# Altium project ECU V1.0 B.PrjPcb (part 3 of 17)
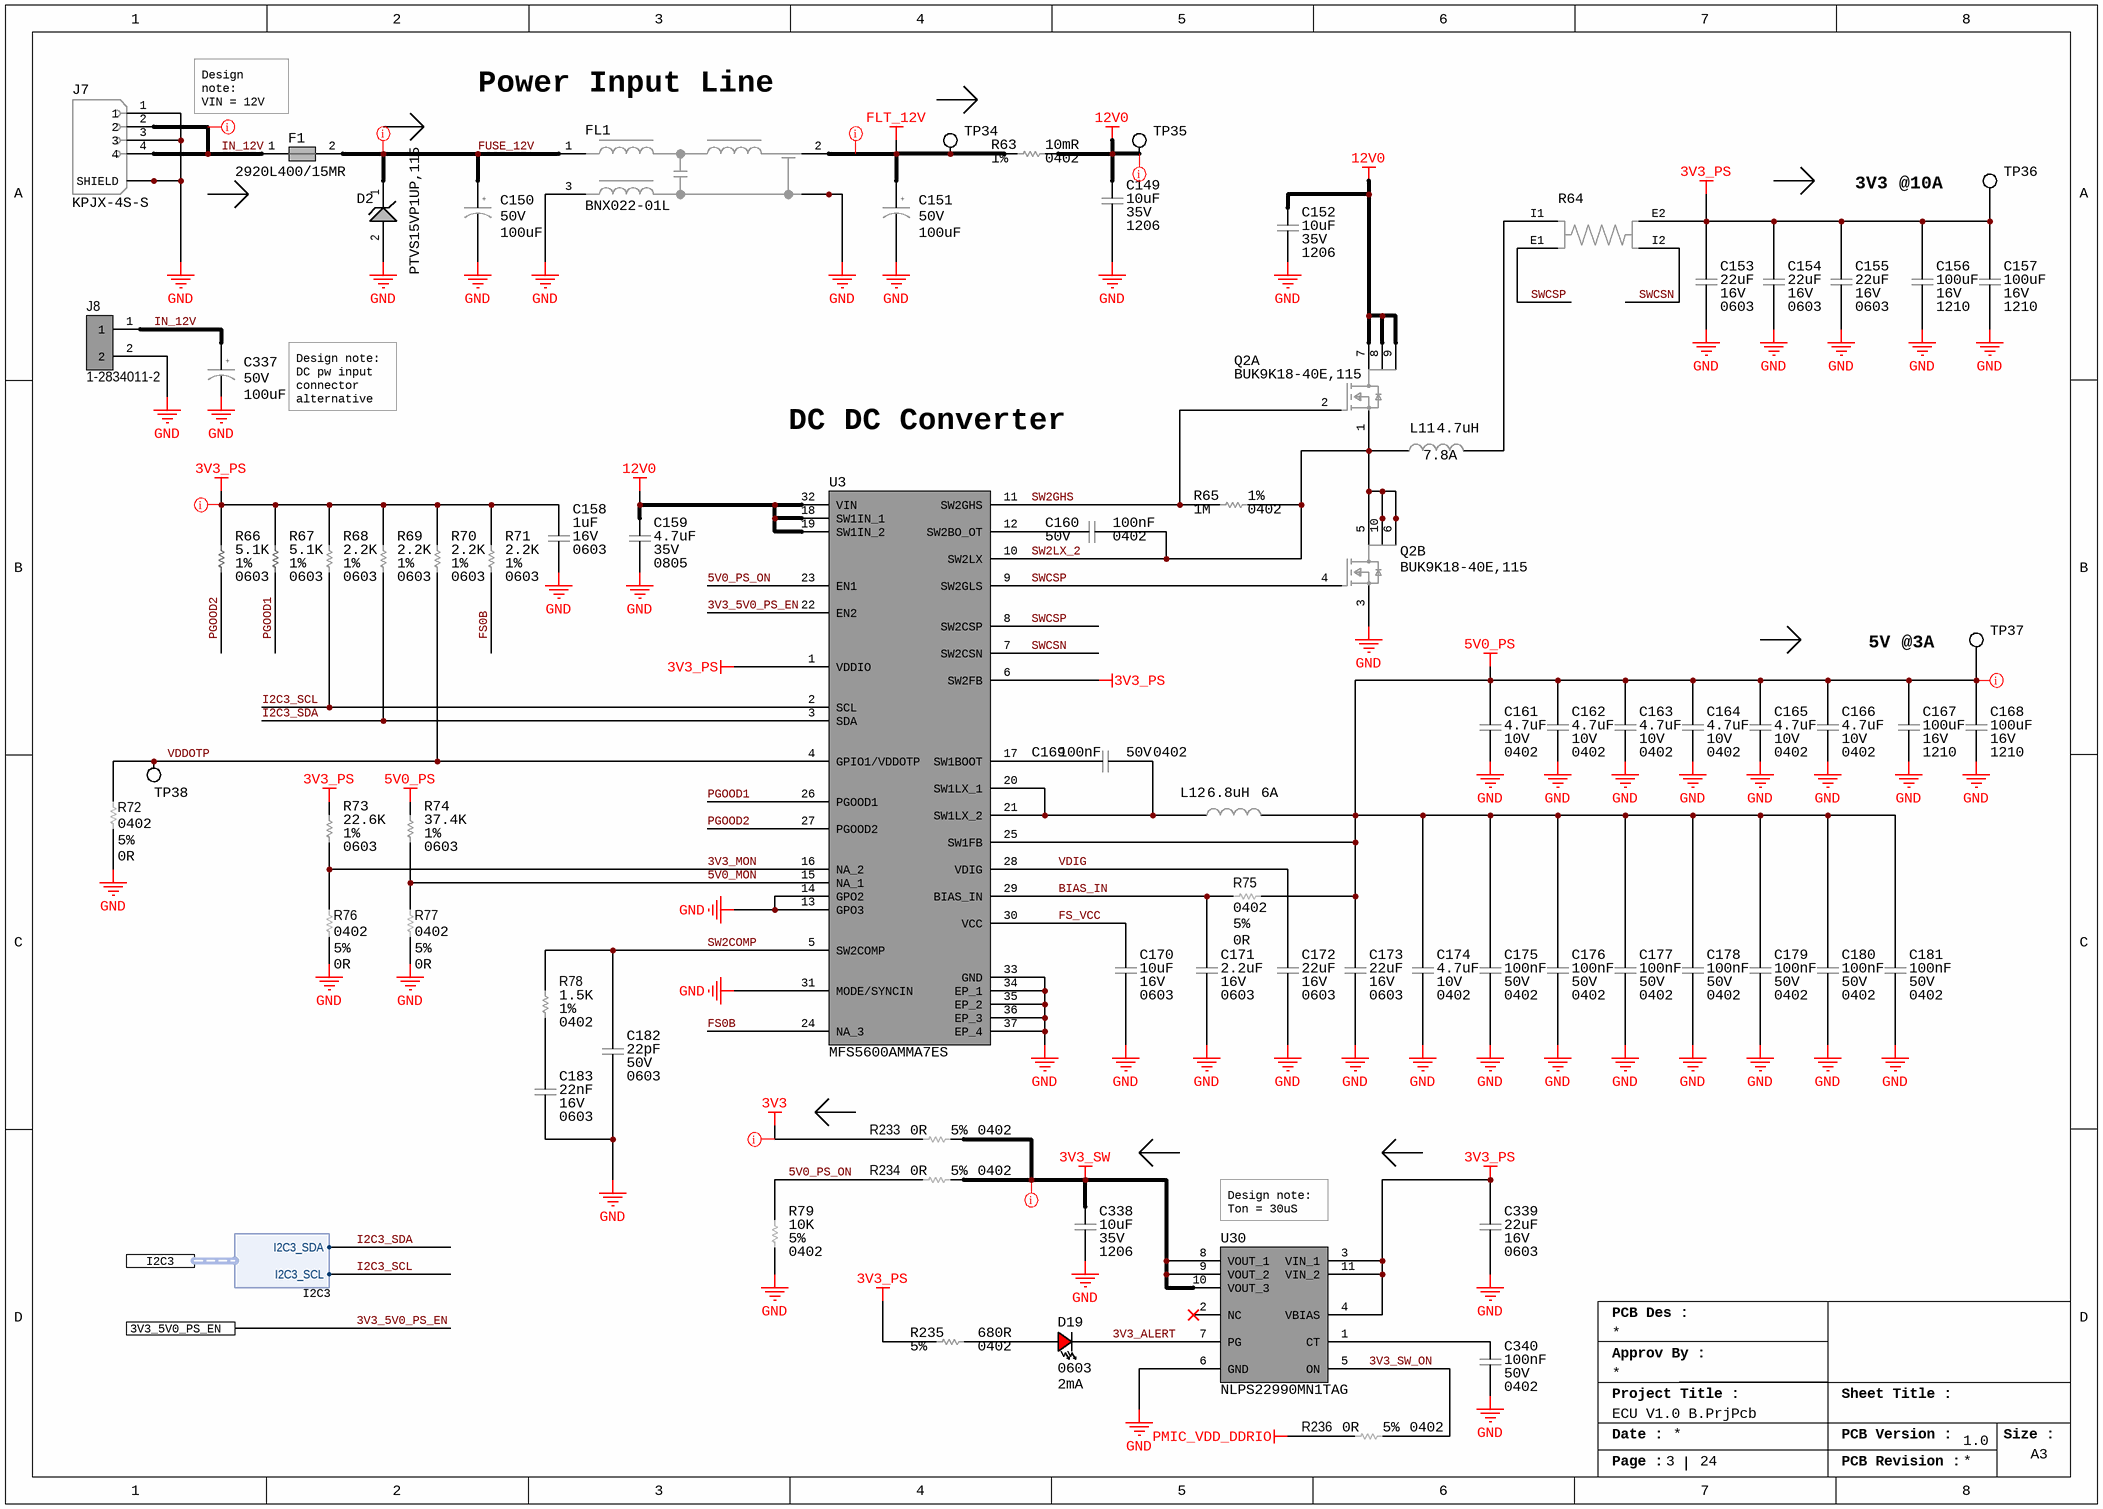
[diagram p19: 02_PWR IN.SchDoc]

## Sheet 02_PWR IN.SchDoc (continued)

### Library data of the parts (continued)
R72 R75-R77 R233 R234 R236 = RES_0R_5%_100mW_0402: SMD Chip Resistor, Jumper, 0 ohm, 100 mW, 0402 [1005 Metric], Thick Film, General Purpose; Manufacturer: Panasonic; Power Rating: 100mW; Voltage Rating: 50V; Temperature Coefficient: 600ppm/°C; Supplier 1: Mouser; Manufacturer Part Number: ERJ-2GE0R00X; RoHS: Yes; Category: Chip SMD Resistors; Stock 1: 10989354; Pricing 1: 1=0.1, 10=0.013, 50=0.013, 100=0.006, 1000=0.004, 2500=0.003, 10000=0.003 (USD); Mount: Surface Mount; Case/Package: 0402; Contact Plating: Tin; Case Code (Metric): 1005; Size Code: 0402; Min Operating Temperature: -55°C; Max Operating Temperature: 155°C; Resistor Type: Thick Film; Packaging: Cut Tape; Package Quantity: 10000; Number of Terminations: 2; Termination: SMD/SMT; Max Power Dissipation: 100mW; Voltage Rating (DC): 50V; Features: Automotive AEC-Q200; Series: ERJ; Construction: Rectangular; Technology: THICK FILM; Length: 1mm; Width: 0.5mm; Height: 0.35mm; Depth: 0.5mm; Ratings: AEC-Q200; Radiation Hardening: No; Reach SVHC Compliant: No; Military Standard: Not; Lead Free: Lead Free; RoHS Compliant: Yes; ComponentLink1URL: https://datasheet.ciiva.com/11821/0900766b80f806dd-11821176.pdf?src-supplier=Rs; ComponentLink1Description: https://datasheet.ciiva.com/11821/0900766b80f806dd-11821176.pdf?src-supplier=Rs; ComponentLink2URL: https://datasheet.ciiva.com/43460/1678796-43460347.pdf?src-supplier=Farnell; ComponentLink2Description: https://datasheet.ciiva.com/43460/1678796-43460347.pdf?src-supplier=Farnell; ComponentLink3URL: https://datasheet.ciiva.com/46389/1678796-46389518.pdf?src-supplier=Element14; ComponentLink3Description: https://datasheet.ciiva.com/46389/1678796-46389518.pdf?src-supplier=Element14; ComponentLink4URL: https://datasheet.ciiva.com/5959/1678796-5959692.pdf?src-supplier=Farnell; ComponentLink4Description: https://datasheet.ciiva.com/5959/1678796-5959692.pdf?src-supplier=Farnell; ComponentLink5URL: https://datasheet.ciiva.com/28695/1678796-28695758.pdf?src-supplier=Element14; ComponentLink5Description: https://datasheet.ciiva.com/28695/1678796-28695758.pdf?src-supplier=Element14; ComponentLink6URL: https://datasheet.ciiva.com/16783/70260739-16783734.pdf?src-supplier=Allied+Electronics; ComponentLink6Description: https://datasheet.ciiva.com/16783/70260739-16783734.pdf?src-supplier=Allied+Electronics; ComponentLink7URL: https://datasheet.ciiva.com/16778/70260739-16778335.pdf?src-supplier=Allied+Electronics; ComponentLink7Description: https://datasheet.ciiva.com/16778/70260739-16778335.pdf?src-supplier=Allied+Electronics; ComponentLink8URL: https://datasheet.ciiva.com/48531/aoa0000ce1-48531077.pdf?src-supplier=Avnet; ComponentLink8Description: https://datasheet.ciiva.com/48531/aoa0000ce1-48531077.pdf?src-supplier=Avnet; ComponentLink9URL: https://datasheet.ciiva.com/30097/4aoa0000ce1-30097116.pdf?src-supplier=Onlinecomponents.com; ComponentLink9Description: https://datasheet.ciiva.com/30097/4aoa0000ce1-30097116.pdf?src-supplier=Onlinecomponents.com; Supplier Part Number 1: 667-ERJ-2GE0R00X
R73 = RES_22.6K_1%_100mW_0603: Res Thick Film 0603 22.6K Ohm 1% 0.1W(1/10W) ±100ppm/C Pad SMD Automotive T/R; Manufacturer: Yageo; Voltage Rating: 50V; Power Rating: 100mW; Temperature Coefficient: 100ppm/°C; Supplier 1: Digikey; Manufacturer Part Number: AC0603FR-0722K6L; RoHS: Yes; Category: Chip SMD Resistors; Stock 1: 61415; Pricing 1: 1=0.1, 10=0.011, 100=0.0102, 1000=0.00816 (USD); Case Code (Imperial): 0603; Case Code (Metric): 1608; Weight: 7.1E-05oz; Min Operating Temperature: -55°C; Max Operating Temperature: 155°C; Packaging: Tape and Reel; Number of Terminations: 2; Termination: SMD/SMT; Max Power Dissipation: 100mW; Features: Moisture Resistant,Automotive AEC-Q200; Series: AC; Length: 0.063inch; Width: 0.8mm; Height: 0.022inch; RoHS Compliant: Yes; ComponentLink1URL: https://datasheet.ciiva.com/12576/pyu-ac-51-rohs-l-2-12576573.pdf?src-supplier=Mouser; ComponentLink1Description: https://datasheet.ciiva.com/12576/pyu-ac-51-rohs-l-2-12576573.pdf?src-supplier=Mouser; Supplier Part Number 1: 13-AC0603FR-0722K6LCT-ND
R74 = RES_37.4K_1%_100mW_0603: SMD Chip Resistor, 37.4 kOhm, ± 1%, 100 mW, 0603 [1608 Metric], Thick Film, General Purpose; Manufacturer: Yageo; Power Rating: 100mW; Voltage Rating: 50V; Temperature Coefficient: 100ppm/°C; Supplier 1: Digikey; Manufacturer Part Number: RC0603FR-0737K4L; RoHS: Yes; Category: Chip SMD Resistors; Stock 1: 85298; Pricing 1: 1=0.1, 10=0.009, 100=0.0071, 1000=0.00612 (USD); Case Code (Metric): 1608; Case Code (Imperial): 0603; Size Code: 0603; Min Operating Temperature: -55°C; Max Operating Temperature: 155°C; Package Quantity: 1; Packaging: Tape and Reel; Number of Terminations: 2; Termination: SMD/SMT; Max Power Dissipation: 100mW; Voltage Rating (DC): 50V; Features: Moisture Resistant; Series: RC; Length: 0.063inch; Width: 0.031inch; Height: 0.022inch; Lead Free: Lead Free; RoHS Compliant: Yes; ComponentLink1URL: https://datasheet.ciiva.com/2455/pyu-r-int-thick-7-2455137.pdf?src-supplier=Digikey; ComponentLink1Description: https://datasheet.ciiva.com/2455/pyu-r-int-thick-7-2455137.pdf?src-supplier=Digikey; ComponentLink2URL: https://datasheet.ciiva.com/2455/pyu-r-int-thick-7-2455138.pdf?src-supplier=Digikey; ComponentLink2Description: https://datasheet.ciiva.com/2455/pyu-r-int-thick-7-2455138.pdf?src-supplier=Digikey; ComponentLink3URL: https://datasheet.ciiva.com/2455/pyu-r-int-thick-7-2455139.pdf?src-supplier=Digikey; ComponentLink3Description: https://datasheet.ciiva.com/2455/pyu-r-int-thick-7-2455139.pdf?src-supplier=Digikey; Supplier Part Number 1: 311-37.4KHRDKR-ND
R78 = RES_1.5K_1%_63mW_0402: Res Thick Film 0402 1.5K Ohm 1% 1/16W ±100ppm/°C Molded SMD SMD Paper Tape on Plastic Reel; Manufacturer: Bourns; Power Rating: 62.5mW; Voltage Rating: 50V; Max Power Dissipation: 63mW; Supplier 1: Digi-Key; Manufacturer Part Number: CR0402-FX-1501GLF; RoHS: Yes; Category: Chip SMD Resistors; Stock 1: 177147; Pricing 1: 1=0.1, 10=0.011, 50=0.0064, 100=0.0051, 500=0.00326, 1000=0.00275, 5000=0.0019 (USD); Mount: Surface Mount; Case Code (Metric): 1005; Case Code (Imperial): 0402; Contact Plating: Tin; Min Operating Temperature: -55°C; Max Operating Temperature: 125°C; Package Quantity: 10000; Packaging: Tape and Reel; Number of Terminations: 2; Termination: SMD/SMT; Temperature Coefficient: 100ppm/°C; Series: CR0402; Voltage Rating (DC): 50V; Length: 0.039inch; Width: 0.5mm; Height: 0.016inch; Thickness: 356um; Radiation Hardening: No; RoHS Compliant: Yes; ComponentLink1URL: https://datasheet.ciiva.com/9123/cr0402-9123423.pdf?src-supplier=Avnet; ComponentLink1Description: https://datasheet.ciiva.com/9123/cr0402-9123423.pdf?src-supplier=Avnet; ComponentLink2URL: https://datasheet.ciiva.com/30173/cr0402-30173227.pdf?src-supplier=Onlinecomponents.com; ComponentLink2Description: https://datasheet.ciiva.com/30173/cr0402-30173227.pdf?src-supplier=Onlinecomponents.com; Supplier Part Number 1: CR0402-FX-1501GLFCT-ND
R79 = RES_10K_5%_100mW_0402: Res Thick Film 0402 10K Ohm 5% 1/10W ±200ppm/°C Molded SMD Punched Carrier T/R; Manufacturer: Panasonic; Power Rating: 100mW; Voltage Rating: 50V; Supplier 1: Digi-Key; Manufacturer Part Number: ERJ-2GEJ103X; RoHS: Yes; Category: Chip SMD Resistors; Stock 1: 4696986; Pricing 1: 1=0.1, 10=0.021, 50=0.0132, 100=0.011, 500=0.00744, 1000=0.00639, 5000=0.00464 (USD); Mount: Surface Mount; Contact Plating: Tin; Case Code (Metric): 1005; Case Code (Imperial): 0402; Size Code: 0402; Min Operating Temperature: -55°C; Max Operating Temperature: 155°C; Temperature Coefficient: 200ppm/°C; Packaging: Cut Tape; Resistor Type: Thick Film; Package Quantity: 10000; Number of Terminations: 2; Termination: SMD/SMT; Max Power Dissipation: 100mW; Features: Automotive AEC-Q200; Series: ERJ; Resistance Tolerance: 5%; Technology: THICK FILM; Voltage Rating (DC): 50V; Length: 1mm; Width: 0.5mm; Height: 0.35mm; Depth: 0.5mm; Ratings: AEC-Q200; Radiation Hardening: No; Reach SVHC Compliant: No; RoHS Compliant: Yes; Lead Free: 5697LeadFree; ComponentLink1URL: https://datasheet.ciiva.com/27055/1935721-27055112.pdf?src-supplier=Jameco; ComponentLink1Description: https://datasheet.ciiva.com/27055/1935721-27055112.pdf?src-supplier=Jameco; ComponentLink2URL: https://datasheet.ciiva.com/11821/0900766b80f806dd-11821170.pdf?src-supplier=Rs; ComponentLink2Description: https://datasheet.ciiva.com/11821/0900766b80f806dd-11821170.pdf?src-supplier=Rs; ComponentLink3URL: https://datasheet.ciiva.com/43460/1678796-43460391.pdf?src-supplier=Farnell; ComponentLink3Description: https://datasheet.ciiva.com/43460/1678796-43460391.pdf?src-supplier=Farnell; ComponentLink4URL: https://datasheet.ciiva.com/22785/1678796-22785949.pdf?src-supplier=Farnell; ComponentLink4Description: https://datasheet.ciiva.com/22785/1678796-22785949.pdf?src-supplier=Farnell; ComponentLink5URL: https://datasheet.ciiva.com/46371/1678796-46371910.pdf?src-supplier=Element14; ComponentLink5Description: https://datasheet.ciiva.com/46371/1678796-46371910.pdf?src-supplier=Element14; ComponentLink6URL: https://datasheet.ciiva.com/28514/1678796-28514154.pdf?src-supplier=Element14; ComponentLink6Description: https://datasheet.ciiva.com/28514/1678796-28514154.pdf?src-supplier=Element14; ComponentLink7URL: https://datasheet.ciiva.com/24070/aoa0000ce1-37422-24070679.pdf?src-supplier=Mouser; ComponentLink7Description: https://datasheet.ciiva.com/24070/aoa0000ce1-37422-24070679.pdf?src-supplier=Mouser; ComponentLink8URL: https://datasheet.ciiva.com/16767/70260739-16767130.pdf?src-supplier=Allied+Electronics; ComponentLink8Description: https://datasheet.ciiva.com/16767/70260739-16767130.pdf?src-supplier=Allied+Electronics; ComponentLink9URL: https://datasheet.ciiva.com/16774/70260739-16774504.pdf?src-supplier=Allied+Electronics; ComponentLink9Description: https://datasheet.ciiva.com/16774/70260739-16774504.pdf?src-supplier=Allied+Electronics; ComponentLink10URL: https://datasheet.ciiva.com/9194/aoa0000ce1-9194140.pdf?src-supplier=Avnet; ComponentLink10Description: https://datasheet.ciiva.com/9194/aoa0000ce1-9194140.pdf?src-supplier=Avnet; Supplier Part Number 1: P10KJCT-ND
R235 = RES_680R_5%_100mW_0402: SMD Chip Resistor, 680 Ohm, ± 5%, 100 mW, 0402 [1005 Metric], Thick Film, General Purpose; Manufacturer: Panasonic; Voltage Rating: 50V; Power Rating: 100mW; Temperature Coefficient: 200ppm/°C; Supplier 1: Digikey; Manufacturer Part Number: ERJ-2GEJ681X; RoHS: Yes; Category: Chip SMD Resistors; Stock 1: 172084; Pricing 1: 1=0.1, 10=0.022, 50=0.0134, 100=0.0111, 500=0.00742, 1000=0.00635, 5000=0.00459 (USD); Mount: Surface Mount; Case Code (Metric): 1005; Case Code (Imperial): 0402; Contact Plating: Tin; Min Operating Temperature: -55°C; Max Operating Temperature: 155°C; Packaging: Tape and Reel; Package Quantity: 10000; Resistor Type: Thick Film; Number of Terminations: 2; Termination: SMD/SMT; Max Power Dissipation: 100mW; Voltage Rating (DC): 50V; Features: Automotive AEC-Q200; Series: ERJ; Technology: THICK FILM; Resistance Tolerance: 5%; Length: 1mm; Width: 0.5mm; Height: 0.35mm; Depth: 0.5mm; Ratings: AEC-Q200; Reach SVHC Compliant: No; RoHS Compliant: Yes; ComponentLink1URL: https://datasheet.ciiva.com/11821/0900766b80f806dd-11821377.pdf?src-supplier=Rs; ComponentLink1Description: https://datasheet.ciiva.com/11821/0900766b80f806dd-11821377.pdf?src-supplier=Rs; ComponentLink2URL: https://datasheet.ciiva.com/24071/aoa0000ce1-37422-24071113.pdf?src-supplier=Mouser; ComponentLink2Description: https://datasheet.ciiva.com/24071/aoa0000ce1-37422-24071113.pdf?src-supplier=Mouser; ComponentLink3URL: https://datasheet.ciiva.com/46389/1500035-46389758.pdf?src-supplier=Element14; ComponentLink3Description: https://datasheet.ciiva.com/46389/1500035-46389758.pdf?src-supplier=Element14; ComponentLink4URL: https://datasheet.ciiva.com/5860/1500035-5860647.pdf?src-supplier=Farnell; ComponentLink4Description: https://datasheet.ciiva.com/5860/1500035-5860647.pdf?src-supplier=Farnell; ComponentLink5URL: https://datasheet.ciiva.com/30051/4aoa0000ce1-30051469.pdf?src-supplier=Onlinecomponents.com; ComponentLink5Description: https://datasheet.ciiva.com/30051/4aoa0000ce1-30051469.pdf?src-supplier=Onlinecomponents.com; ComponentLink6URL: https://datasheet.ciiva.com/28590/1678796-28590759.pdf?src-supplier=Element14; ComponentLink6Description: https://datasheet.ciiva.com/28590/1678796-28590759.pdf?src-supplier=Element14; ComponentLink7URL: https://datasheet.ciiva.com/16760/70260739-16760549.pdf?src-supplier=Allied+Electronics; ComponentLink7Description: https://datasheet.ciiva.com/16760/70260739-16760549.pdf?src-supplier=Allied+Electronics; ComponentLink8URL: https://datasheet.ciiva.com/16781/70260739-16781851.pdf?src-supplier=Allied+Electronics; ComponentLink8Description: https://datasheet.ciiva.com/16781/70260739-16781851.pdf?src-supplier=Allied+Electronics; Supplier Part Number 1: P680JCT-ND
TP34-TP38 = TP_PAD_SMD_SMALL: Test Point, SMD pad, round, 1.5mm, 1.6mm, 3mm diameter
U3 = IC_REG_BUCK_MFS5600AMMA7ES: Power Management, 36 V, 2 Step-Down DC-DC Converters, 2 Regulated Outputs, 32 Pins, HVQFN-EP; Manufacturer: NXP Semiconductors; Supplier 1: Digikey; Manufacturer Part Number: MFS5600AMMA7ES; RoHS: No; Category: Power Management ICs; Stock 1: 26; Pricing 1: 1=4.59, 10=3.486, 25=3.21, 100=2.9069, 490=2.67757, 980=2.60545, 1470=2.56933, 2940=2.51636 (USD); Supplier Part Number 1: 568-MFS5600AMMA7ES-ND
U30 = IC_LOAD_SW_NLPS22990MN1TAG: 5.5 V, 10 A, 3.9 mΩ On-Resistance Load Switch 5.5 V, 10 A, 3.9 mOhm On-Resistance; Manufacturer: onsemi; Interface: On/Off; Number of Outputs: 1; Output Configuration: High Side; Max Output Current: 10A; Supplier 1: Digikey; Manufacturer Part Number: NLPS22990MN1TAG; RoHS: Yes; Category: Power Management ICs; Stock 1: 2325; Pricing 1: 1=1.07, 10=0.771, 25=0.696, 100=0.6141, 250=0.575, 500=0.55142, 1000=0.532 (USD); Mount: Surface Mount; Number of Pins: 10; Min Operating Temperature: -40°C; Max Operating Temperature: 105°C; Series: -; RoHS Compliant: Yes; ComponentLink1URL: https://datasheet.octopart.com/NLPS22990MN1TAG-ON-Semiconductor-datasheet-139012747.pdf?src-supplier=Farnell; ComponentLink1Description: https://datasheet.octopart.com/NLPS22990MN1TAG-ON-Semiconductor-datasheet-139012747.pdf?src-supplier=Farnell; ComponentLink2URL: https://www.onsemi.com/pub/Collateral/NLPS22990-D.PDF?src-supplier=Digikey; ComponentLink2Description: https://www.onsemi.com/pub/Collateral/NLPS22990-D.PDF?src-supplier=Digikey; ComponentLink3URL: https://datasheet.octopart.com/NLPS22990MN1TAG-ON-Semiconductor-datasheet-139012747.pdf?src-supplier=Master+Electronics; ComponentLink3Description: https://datasheet.octopart.com/NLPS22990MN1TAG-ON-Semiconductor-datasheet-139012747.pdf?src-supplier=Master+Electronics; Supplier Part Number 1: 488-NLPS22990MN1TAGCT-ND